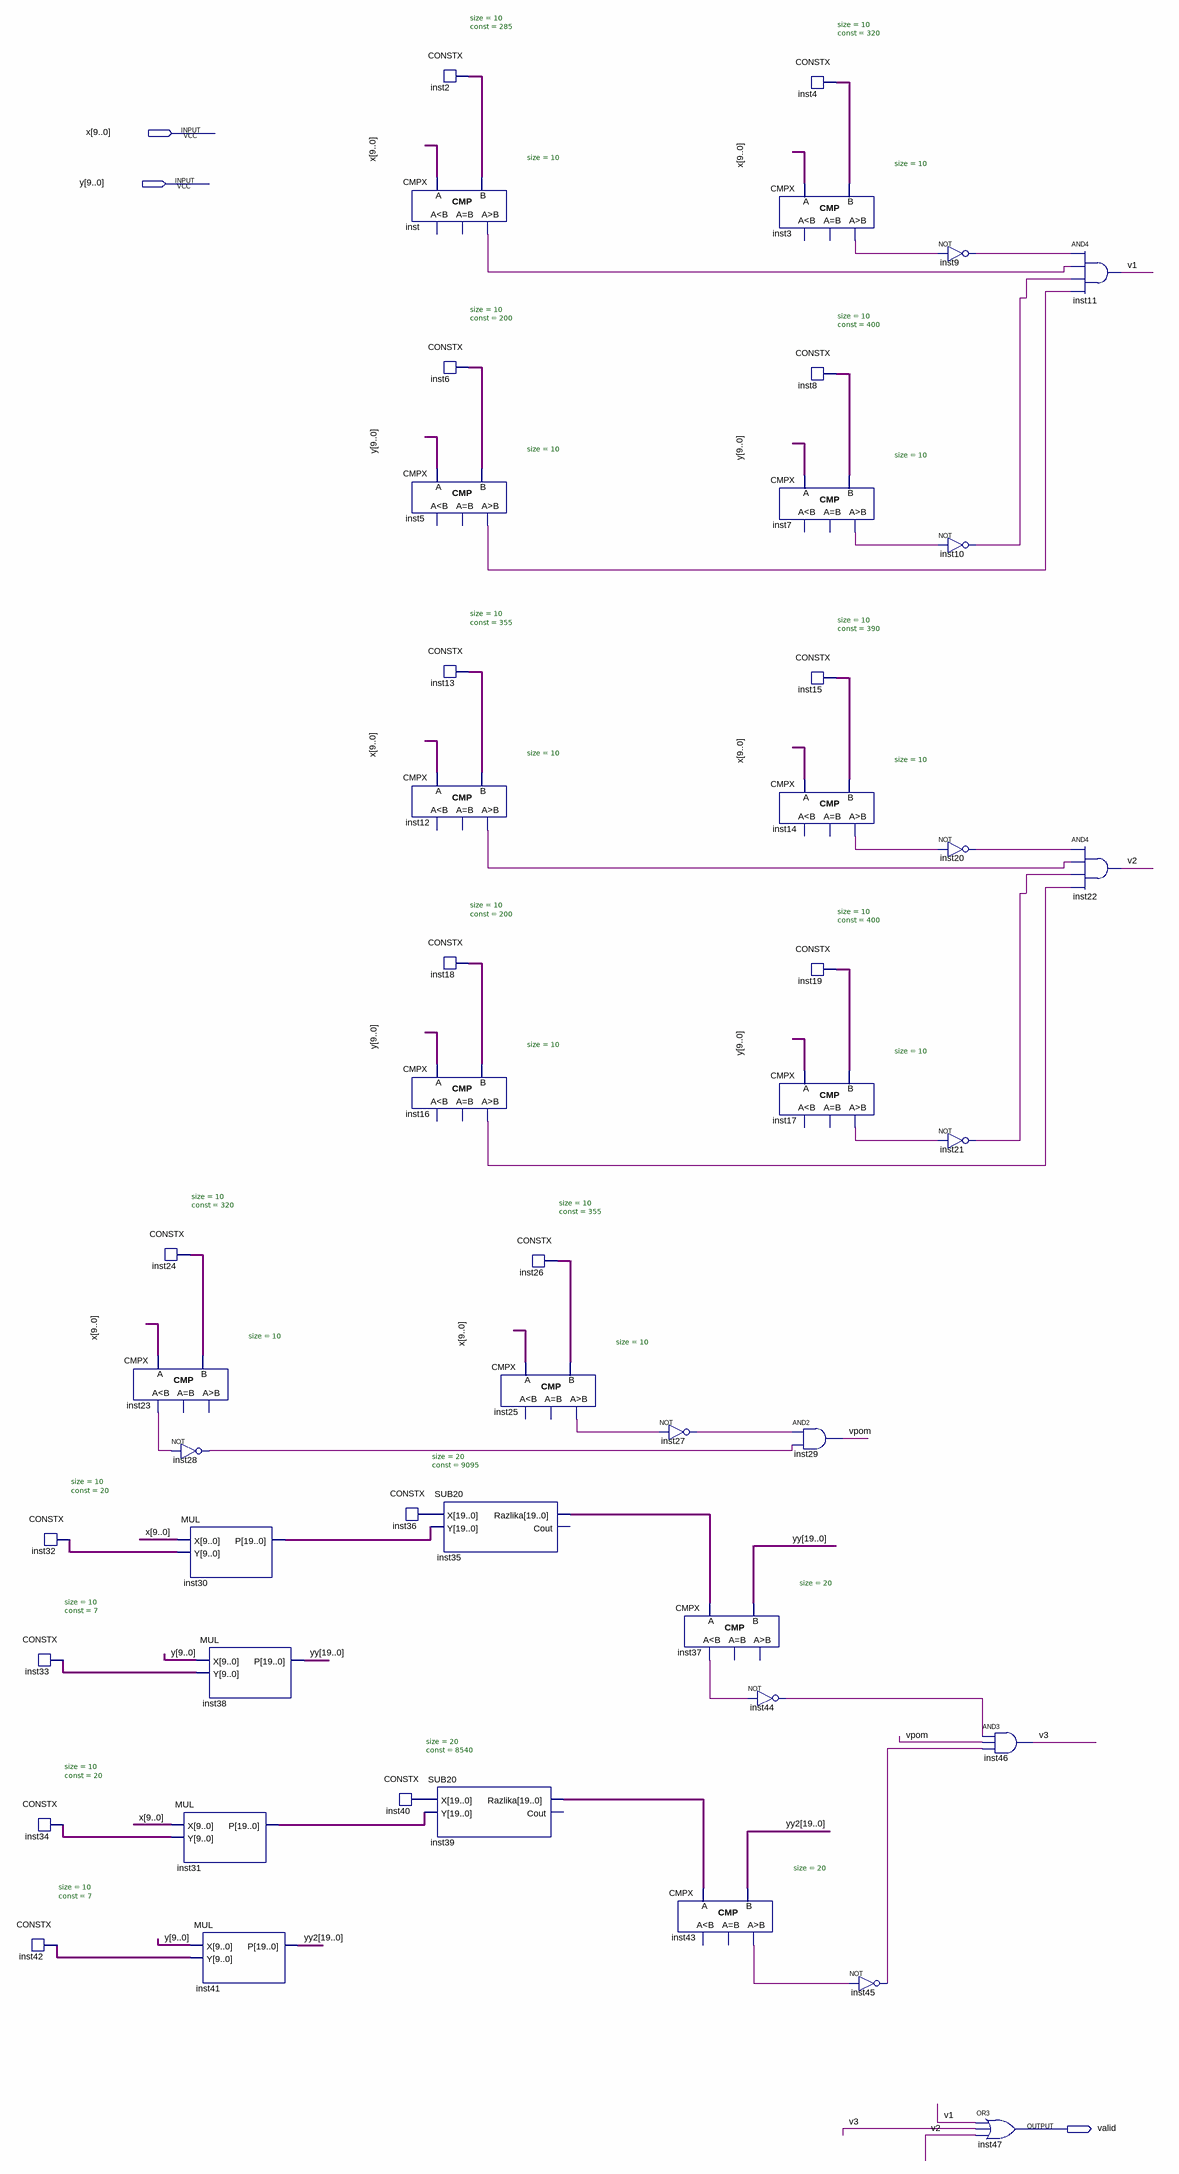
[diagram p0: schematic sheet]
// Quartus schematic slovoI.bdf as structural Verilog: 47 symbols, 3 pins
module slovoI (
  input  [9:0] x,
  input  [9:0] y,
  output valid
);

  wire inst3_gr, inst5_gr, inst7_gr, inst9_out, inst10_out, inst12_gr, inst14_gr, inst16_gr, inst17_gr,
       inst20_out, inst21_out, inst23_ls, inst25_gr, inst27_out, inst28_out, inst37_ls, inst43_gr,
       inst44_out, inst45_out, inst_gr, v1, v2, v3, vpom;
  wire [9:0] inst2_data, inst4_data, inst6_data, inst8_data, inst13_data, inst15_data, inst18_data,
       inst19_data, inst24_data, inst26_data, inst32_data, inst33_data, inst34_data, inst42_data;
  wire [19:0] inst30_p, inst31_p, inst35_razlika, inst36_data, inst39_razlika, inst40_data, yy, yy2;

  CONSTX #(.size(10), .\const (20)) inst32 (.data(inst32_data));
  CONSTX #(.size(10), .\const (7)) inst33 (.data(inst33_data));
  CONSTX #(.size(10), .\const (20)) inst34 (.data(inst34_data));
  CONSTX #(.size(10), .\const (7)) inst42 (.data(inst42_data));
  CONSTX #(.size(10), .\const (320)) inst24 (.data(inst24_data));
  CMPX #(.size(10)) inst23 (.A(x), .B(inst24_data), .ls(inst23_ls));  // open: eq, gr
  not inst28 (inst28_out, inst23_ls);
  MUL inst30 (.X(x), .Y(inst32_data), .P(inst30_p));
  MUL inst38 (.X(y), .Y(inst33_data), .P(yy));
  MUL inst31 (.X(x), .Y(inst34_data), .P(inst31_p));
  MUL inst41 (.X(y), .Y(inst42_data), .P(yy2));
  CMPX #(.size(10)) inst (.A(x), .B(inst2_data), .gr(inst_gr));  // open: ls, eq
  CMPX #(.size(10)) inst5 (.A(y), .B(inst6_data), .gr(inst5_gr));  // open: ls, eq
  CMPX #(.size(10)) inst12 (.A(x), .B(inst13_data), .gr(inst12_gr));  // open: ls, eq
  CMPX #(.size(10)) inst16 (.A(y), .B(inst18_data), .gr(inst16_gr));  // open: ls, eq
  CONSTX #(.size(20), .\const (9095)) inst36 (.data(inst36_data));
  CONSTX #(.size(20), .\const (8540)) inst40 (.data(inst40_data));
  CONSTX #(.size(10), .\const (285)) inst2 (.data(inst2_data));
  CONSTX #(.size(10), .\const (200)) inst6 (.data(inst6_data));
  CONSTX #(.size(10), .\const (355)) inst13 (.data(inst13_data));
  CONSTX #(.size(10), .\const (200)) inst18 (.data(inst18_data));
  SUB20 inst35 (.X(inst36_data), .Y(inst30_p), .Razlika(inst35_razlika));  // open: Cout
  SUB20 inst39 (.X(inst40_data), .Y(inst31_p), .Razlika(inst39_razlika));  // open: Cout
  CONSTX #(.size(10), .\const (355)) inst26 (.data(inst26_data));
  CMPX #(.size(10)) inst25 (.A(x), .B(inst26_data), .gr(inst25_gr));  // open: ls, eq
  not inst27 (inst27_out, inst25_gr);
  CMPX #(.size(20)) inst43 (.A(inst39_razlika), .B(yy2), .gr(inst43_gr));  // open: ls, eq
  CMPX #(.size(20)) inst37 (.A(inst35_razlika), .B(yy), .ls(inst37_ls));  // open: eq, gr
  CMPX #(.size(10)) inst3 (.A(x), .B(inst4_data), .gr(inst3_gr));  // open: ls, eq
  CMPX #(.size(10)) inst7 (.A(y), .B(inst8_data), .gr(inst7_gr));  // open: ls, eq
  CMPX #(.size(10)) inst14 (.A(x), .B(inst15_data), .gr(inst14_gr));  // open: ls, eq
  CMPX #(.size(10)) inst17 (.A(y), .B(inst19_data), .gr(inst17_gr));  // open: ls, eq
  not inst44 (inst44_out, inst37_ls);
  CONSTX #(.size(10), .\const (320)) inst4 (.data(inst4_data));
  CONSTX #(.size(10), .\const (400)) inst8 (.data(inst8_data));
  CONSTX #(.size(10), .\const (390)) inst15 (.data(inst15_data));
  CONSTX #(.size(10), .\const (400)) inst19 (.data(inst19_data));
  and inst29 (vpom, inst27_out, inst28_out);
  not inst45 (inst45_out, inst43_gr);
  not inst9 (inst9_out, inst3_gr);
  not inst10 (inst10_out, inst7_gr);
  not inst20 (inst20_out, inst14_gr);
  not inst21 (inst21_out, inst17_gr);
  and inst46 (v3, inst44_out, vpom, inst45_out);
  or inst47 (valid, v1, v3, v2);
  and inst11 (v1, inst9_out, inst_gr, inst10_out, inst5_gr);
  and inst22 (v2, inst20_out, inst12_gr, inst21_out, inst16_gr);
endmodule
